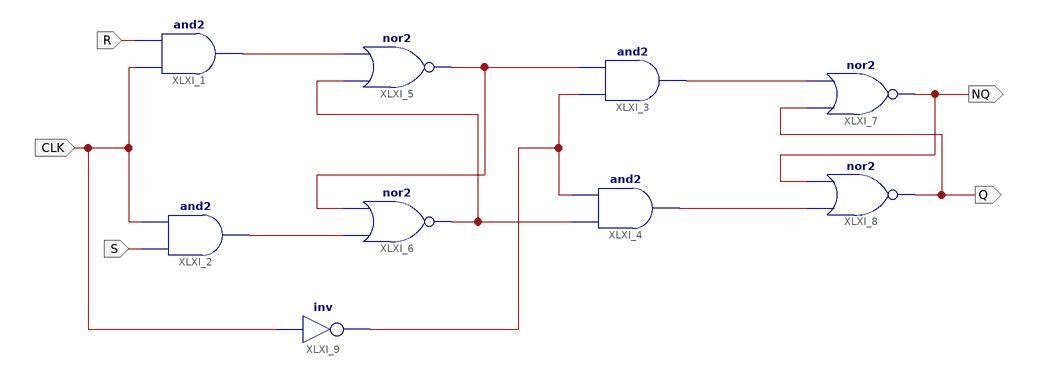
[diagram p0: schematic sheet 1]
// Xilinx ISE schematic FlipFlop_RS_MasterSlave.sch (artix7) as structural Verilog: 9 symbols, 5 ports
module FlipFlop_RS_MasterSlave (
  input  S,
  input  CLK,
  input  R,
  output Q,
  output NQ
);

  wire XLXN_4, XLXN_5, XLXN_11, XLXN_12, XLXN_13, XLXN_14, XLXN_16;

  and XLXI_1 (XLXN_4, CLK, R);
  and XLXI_2 (XLXN_5, S, CLK);
  and XLXI_3 (XLXN_11, XLXN_16, XLXN_13);
  and XLXI_4 (XLXN_12, XLXN_14, XLXN_16);
  nor XLXI_7 (NQ, Q, XLXN_11);
  nor XLXI_8 (Q, XLXN_12, NQ);
  not XLXI_9 (XLXN_16, CLK);
  nor XLXI_5 (XLXN_13, XLXN_14, XLXN_4);
  nor XLXI_6 (XLXN_14, XLXN_5, XLXN_13);
endmodule
